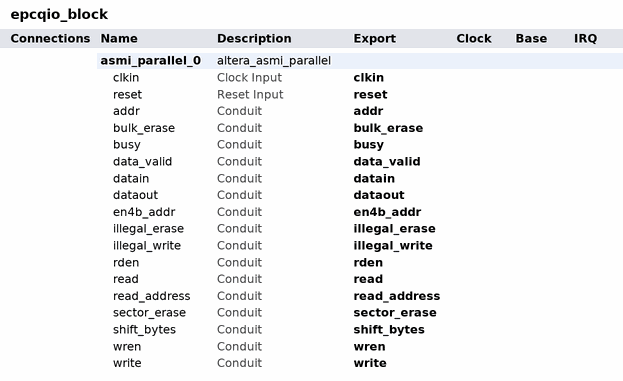
[diagram p0: system contents]
# Platform Designer (Qsys) system epcqio_block, Arria V 5AGXFB5H4F35C4
# Parameters at their usual value, and those the tool derives, are not listed.
package require -exact qsys 15.1
create_system epcqio_block
set_project_property DEVICE_FAMILY {Arria V}
set_project_property DEVICE 5AGXFB5H4F35C4

add_instance asmi_parallel_0 altera_asmi_parallel 15.1
set_instance_property asmi_parallel_0 AUTO_EXPORT true
set_instance_parameter_value asmi_parallel_0 CBX_AUTO_BLACKBOX ALL
set_instance_parameter_value asmi_parallel_0 DATA_WIDTH STANDARD
set_instance_parameter_value asmi_parallel_0 ENABLE_SIM false
set_instance_parameter_value asmi_parallel_0 EPCS_TYPE EPCQ256
set_instance_parameter_value asmi_parallel_0 FLASH_RSTPIN FALSE
set_instance_parameter_value asmi_parallel_0 PAGE_SIZE 256
set_instance_parameter_value asmi_parallel_0 WRITE_DUMMY_CLK 0
set_instance_parameter_value asmi_parallel_0 gui_bulk_erase true
set_instance_parameter_value asmi_parallel_0 gui_die_erase false
set_instance_parameter_value asmi_parallel_0 gui_ex4b_addr false
set_instance_parameter_value asmi_parallel_0 gui_fast_read false
set_instance_parameter_value asmi_parallel_0 gui_page_write true
set_instance_parameter_value asmi_parallel_0 gui_read_address true
set_instance_parameter_value asmi_parallel_0 gui_read_dummyclk false
set_instance_parameter_value asmi_parallel_0 gui_read_rdid false
set_instance_parameter_value asmi_parallel_0 gui_read_sid false
set_instance_parameter_value asmi_parallel_0 gui_read_status false
set_instance_parameter_value asmi_parallel_0 gui_sector_erase true
set_instance_parameter_value asmi_parallel_0 gui_sector_protect false
set_instance_parameter_value asmi_parallel_0 gui_single_write false
set_instance_parameter_value asmi_parallel_0 gui_use_asmiblock false
set_instance_parameter_value asmi_parallel_0 gui_use_eab false
set_instance_parameter_value asmi_parallel_0 gui_wren true
set_instance_parameter_value asmi_parallel_0 gui_write true

# exported interfaces
add_interface addr conduit end
set_interface_property addr EXPORT_OF asmi_parallel_0.addr
add_interface bulk_erase conduit end
set_interface_property bulk_erase EXPORT_OF asmi_parallel_0.bulk_erase
add_interface busy conduit end
set_interface_property busy EXPORT_OF asmi_parallel_0.busy
add_interface clkin clock sink
set_interface_property clkin EXPORT_OF asmi_parallel_0.clkin
add_interface data_valid conduit end
set_interface_property data_valid EXPORT_OF asmi_parallel_0.data_valid
add_interface datain conduit end
set_interface_property datain EXPORT_OF asmi_parallel_0.datain
add_interface dataout conduit end
set_interface_property dataout EXPORT_OF asmi_parallel_0.dataout
add_interface en4b_addr conduit end
set_interface_property en4b_addr EXPORT_OF asmi_parallel_0.en4b_addr
add_interface illegal_erase conduit end
set_interface_property illegal_erase EXPORT_OF asmi_parallel_0.illegal_erase
add_interface illegal_write conduit end
set_interface_property illegal_write EXPORT_OF asmi_parallel_0.illegal_write
add_interface rden conduit end
set_interface_property rden EXPORT_OF asmi_parallel_0.rden
add_interface read conduit end
set_interface_property read EXPORT_OF asmi_parallel_0.read
add_interface read_address conduit end
set_interface_property read_address EXPORT_OF asmi_parallel_0.read_address
add_interface reset reset sink
set_interface_property reset EXPORT_OF asmi_parallel_0.reset
add_interface sector_erase conduit end
set_interface_property sector_erase EXPORT_OF asmi_parallel_0.sector_erase
add_interface shift_bytes conduit end
set_interface_property shift_bytes EXPORT_OF asmi_parallel_0.shift_bytes
add_interface wren conduit end
set_interface_property wren EXPORT_OF asmi_parallel_0.wren
add_interface write conduit end
set_interface_property write EXPORT_OF asmi_parallel_0.write

set_interconnect_requirement {$system} qsys_mm.clockCrossingAdapter HANDSHAKE
set_interconnect_requirement {$system} qsys_mm.enableEccProtection FALSE
set_interconnect_requirement {$system} qsys_mm.insertDefaultSlave FALSE
set_interconnect_requirement {$system} qsys_mm.maxAdditionalLatency 1

save_system epcqio_block.qsys
